# Altium schematic sheet Half_Bridges.SchDoc
size B; DocumentNumber: 6; SheetNumber: 4; SheetTotal: 4
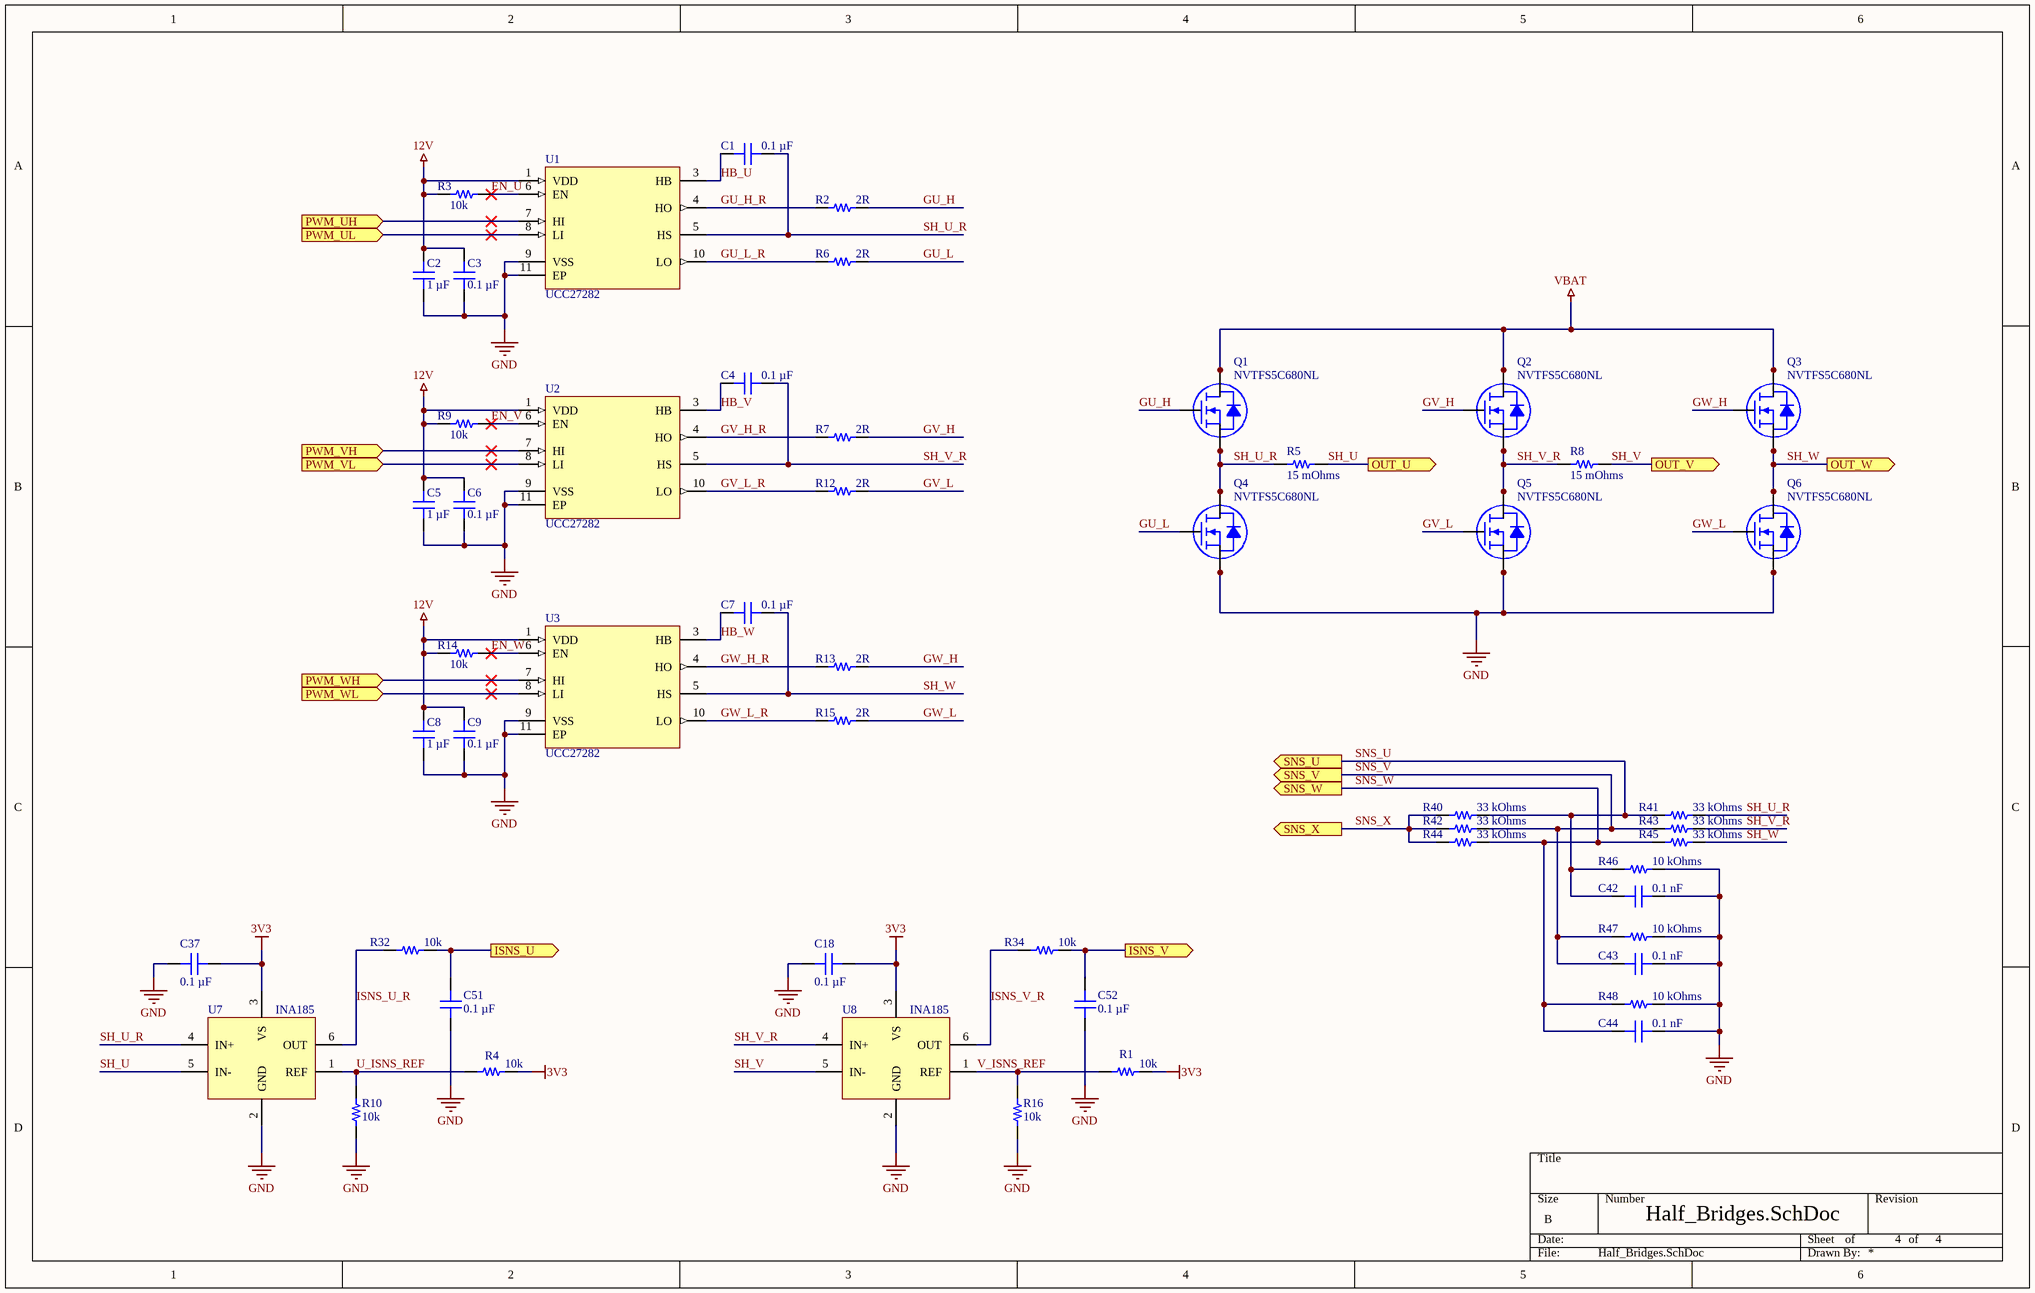
[diagram p0: Half_Bridges.SchDoc]

## Parts
C1  0.1 µF  [CAP 0402_1005]
C2  1 µF  [CAP 0402_1005]
C3  0.1 µF  [CAP 0402_1005]
C4  0.1 µF  [CAP 0402_1005]
C5  1 µF  [CAP 0402_1005]
C6  0.1 µF  [CAP 0402_1005]
C7  0.1 µF  [CAP 0402_1005]
C8  1 µF  [CAP 0402_1005]
C9  0.1 µF  [CAP 0402_1005]
C18  0.1 µF  [CAP 0402_1005]
C37  0.1 µF  [CAP 0402_1005]
C42  0.1 nF  [CAP 0402_1005]
C43  0.1 nF  [CAP 0402_1005]
C44  0.1 nF  [CAP 0402_1005]
C51  0.1 µF  [CAP 0402_1005]
C52  0.1 µF  [CAP 0402_1005]
Q1  NVTFS5C680NL  [NVTFS015N04CTAG]
Q2  NVTFS5C680NL  [NVTFS015N04CTAG]
Q3  NVTFS5C680NL  [NVTFS015N04CTAG]
Q4  NVTFS5C680NL  [NVTFS015N04CTAG]
Q5  NVTFS5C680NL  [NVTFS015N04CTAG]
Q6  NVTFS5C680NL  [NVTFS015N04CTAG]
R1  10k  [RES 0402_1005]
R2  2R  [RES 0402_1005]
R3  10k  [RES 0402_1005]
R4  10k  [RES 0402_1005]
R5  15 mOhms  [RES 1206_3216]
R6  2R  [RES 0402_1005]
R7  2R  [RES 0402_1005]
R8  15 mOhms  [RES 1206_3216]
R9  10k  [RES 0402_1005]
R10  10k  [RES 0402_1005]
R12  2R  [RES 0402_1005]
R13  2R  [RES 0402_1005]
R14  10k  [RES 0402_1005]
R15  2R  [RES 0402_1005]
R16  10k  [RES 0402_1005]
R32  10k  [RES 0402_1005]
R34  10k  [RES 0402_1005]
R40  33 kOhms  [RES 0402_1005]
R41  33 kOhms  [RES 0402_1005]
R42  33 kOhms  [RES 0402_1005]
R43  33 kOhms  [RES 0402_1005]
R44  33 kOhms  [RES 0402_1005]
R45  33 kOhms  [RES 0402_1005]
R46  10 kOhms  [RES 0402_1005]
R47  10 kOhms  [RES 0402_1005]
R48  10 kOhms  [RES 0402_1005]
U1  UCC27282  [VSON-10]
U2  UCC27282  [VSON-10]
U3  UCC27282  [VSON-10]
U7  INA185  [TI SC70-6 DCK]
U8  INA185  [TI SC70-6 DCK]

## Ports
ISNS_U (out), ISNS_V (out), OUT_U (out), OUT_V (out), OUT_W (out), PWM_UH (in), PWM_UL (in), PWM_VH (in), PWM_VL (in), PWM_WH (in), PWM_WL (in), SNS_U (out), SNS_V (out), SNS_W (out), SNS_X (out)

## Nets
3V3: C18.1 C37.1 R1.2 R4.2 U7.3(VS) U8.3(VS)
12V: C2.1 C3.1 C5.1 C6.1 C8.1 C9.1 R3.2 R9.2 R14.2 U1.1(VDD) U2.1(VDD) U3.1(VDD)
GND: C2.2 C3.2 C5.2 C6.2 C8.2 C9.2 C18.2 C37.2 C42.1 C43.1 C44.1 C51.2 C52.2 Q4.1(S) Q4.2(S) Q4.3(S) Q5.1(S) Q5.2(S) Q5.3(S) Q6.1(S) Q6.2(S) Q6.3(S) R10.1 R16.1 R46.1 R47.1 R48.1 U1.9(VSS) U1.11(EP) U2.9(VSS) U2.11(EP) U3.9(VSS) U3.11(EP) U7.2(GND) U8.2(GND)
VBAT: Q1.5(D) Q1.6(D) Q1.7(D) Q1.8(D) Q2.5(D) Q2.6(D) Q2.7(D) Q2.8(D) Q3.5(D) Q3.6(D) Q3.7(D) Q3.8(D)
EN_U: R3.1 U1.6(EN)
EN_V: R9.1 U2.6(EN)
EN_W: R14.1 U3.6(EN)
GU_H: Q1.4(G) R2.1
GU_H_R: R2.2 U1.4(HO)
GU_L: Q4.4(G) R6.1
GU_L_R: R6.2 U1.10(LO)
GV_H: Q2.4(G) R7.1
GV_H_R: R7.2 U2.4(HO)
GV_L: Q5.4(G) R12.1
GV_L_R: R12.2 U2.10(LO)
GW_H: Q3.4(G) R13.1
GW_H_R: R13.2 U3.4(HO)
GW_L: Q6.4(G) R15.1
GW_L_R: R15.2 U3.10(LO)
HB_U: C1.2 U1.3(HB)
HB_V: C4.2 U2.3(HB)
HB_W: C7.2 U3.3(HB)
ISNS_U: C51.1 R32.2 ; port ISNS_U
ISNS_U_R: R32.1 U7.6(OUT)
ISNS_V: C52.1 R34.2 ; port ISNS_V
ISNS_V_R: R34.1 U8.6(OUT)
PWM_UH: U1.7(HI) ; port PWM_UH
PWM_UL: U1.8(LI) ; port PWM_UL
PWM_VH: U2.7(HI) ; port PWM_VH
PWM_VL: U2.8(LI) ; port PWM_VL
PWM_WH: U3.7(HI) ; port PWM_WH
PWM_WL: U3.8(LI) ; port PWM_WL
SH_U: R5.2 U7.5(IN-) ; port OUT_U
SH_U_R: C1.1 Q1.1(S) Q1.2(S) Q1.3(S) Q4.5(D) Q4.6(D) Q4.7(D) Q4.8(D) R5.1 R41.2 U1.5(HS) U7.4(IN+)
SH_V: R8.2 U8.5(IN-) ; port OUT_V
SH_V_R: C4.1 Q2.1(S) Q2.2(S) Q2.3(S) Q5.5(D) Q5.6(D) Q5.7(D) Q5.8(D) R8.1 R43.2 U2.5(HS) U8.4(IN+)
SH_W: C7.1 Q3.1(S) Q3.2(S) Q3.3(S) Q6.5(D) Q6.6(D) Q6.7(D) Q6.8(D) R45.2 U3.5(HS) ; port OUT_W
SNS_U: C42.2 R40.2 R41.1 R46.2 ; port SNS_U
SNS_V: C43.2 R42.2 R43.1 R47.2 ; port SNS_V
SNS_W: C44.2 R44.2 R45.1 R48.2 ; port SNS_W
SNS_X: R40.1 R42.1 R44.1 ; port SNS_X
U_ISNS_REF: R4.1 R10.2 U7.1(REF)
V_ISNS_REF: R1.1 R16.2 U8.1(REF)

## Notes on the sheet
- of

## Library data of the parts
C1 C3 C4 C6 C7 C9 C18 C37 C51 C52 = C0402C104K4RACAUTO: CAP CER 0.1UF 16V X7R 0402; manufacturer: KEMET; Tolerance: ±10%; Part Number: C0402C104K4RACAUTO; Value: 0.1 µF; Applications: Automotive, Bypass, Decoupling; Capacitance: 0.1 µF; componentlink1description: Datasheet; componentlink1url: https://api.kemet.com/component-edge/download/specsheet/C0402C104K4RACAUTO.pdf; componentlink2description: DigiKey Link; componentlink2url: https://www.digikey.com/en/products/detail/kemet/C0402C104K4RACAUTO/3314827; Device Package: 0402 (1005 Metric); lastupdated: 8/14/2022 9:05:51 PM; Lifecycle Status: Active; Minimum Order: 1; Mounting Type: Surface Mount, MLCC; Operating Temperature: -55°C ~ 125°C; Package / Case: 0402 (1005 Metric); packaging: TapeAndReel; partid: 3024; Part Status: Active; price: 0.01; Ratings: AEC-Q200; series: SMD Auto X7R; Size / Dimension: 0.039" L x 0.020" W (1.00mm x 0.50mm); Supplier 1: DigiKey; Supplier Part Number 1: 399-6828-1-ND; Temperature Coefficient: X7R; Thickness (Max): 0.022" (0.55mm); Voltage - Rated: 16V
C2 C5 C8 C42-C44 = C0402C104K4RACAUTO: CAP CER 0.1UF 16V X7R 0402; manufacturer: KEMET; Capacitance: 0.1 µF; Tolerance: ±10%; Part Number: C0402C104K4RACAUTO; Applications: Automotive, Bypass, Decoupling; componentlink1description: Datasheet; componentlink1url: https://api.kemet.com/component-edge/download/specsheet/C0402C104K4RACAUTO.pdf; componentlink2description: DigiKey Link; componentlink2url: https://www.digikey.com/en/products/detail/kemet/C0402C104K4RACAUTO/3314827; Device Package: 0402 (1005 Metric); lastupdated: 8/14/2022 9:05:51 PM; Lifecycle Status: Active; Minimum Order: 1; Mounting Type: Surface Mount, MLCC; Operating Temperature: -55°C ~ 125°C; Package / Case: 0402 (1005 Metric); packaging: TapeAndReel; partid: 3024; Part Status: Active; price: 0.01; Ratings: AEC-Q200; series: SMD Auto X7R; Size / Dimension: 0.039" L x 0.020" W (1.00mm x 0.50mm); Supplier 1: DigiKey; Supplier Part Number 1: 399-6828-1-ND; Temperature Coefficient: X7R; Thickness (Max): 0.022" (0.55mm); Voltage - Rated: 16V
  C2 C5 C8: Value: 1 µF
  C42-C44: Value: 0.1 nF
Q1-Q6 = NVTFS5C680NL: N-FET
R1-R4 R6 R7 R9 R10 R12-R16 R32 R34 R40-R48 = RK73H1ETTP1432F: RES 14.3K OHM 1% 1/10W 0402; Manufacturer: KOA Speer Electronics, Inc.; Power (Watts): 0.1W, 1/10W; Resistance: 14.3 kOhms; Temperature Coefficient: ±100ppm/°C; Part Number: RK73H1ETTP1432F; ComponentLink1Description: Datasheet; ComponentLink1URL: http://www.koaspeer.com/catimages/Products/RK73H/RK73H.pdf; ComponentLink2Description: DigiKey Link; ComponentLink2URL: https://www.digikey.com/en/products/detail/koa-speer-electronics-inc/RK73H1ETTP1432F/9844351; Composition: Thick Film; Device Package: 0402 (1005 Metric); Features: Automotive AEC-Q200, Moisture Resistant; Height - Seated (Max): 0.016" (0.40mm); LastUpdated: 8/14/2022 9:23:49 PM; Lifecycle Status: Active; Minimum Order: 1; Number of Terminations: 2; Operating Temperature: -55°C ~ 155°C; Package / Case: 0402 (1005 Metric); Packaging: CutTape; PartId: 10193; Part Status: Active; Price: 0.01; Ratings: AEC-Q200; Series: RK73H; Size / Dimension: 0.039" L x 0.020" W (1.00mm x 0.50mm); Supplier 1: DigiKey; Supplier Part Number 1: 2019-RK73H1ETTP1432FCT-ND; Supplier Device Package: 0402; Tolerance: ±1%
  R1 R3 R4 R9 R10 R14 R16 R32 R34: Value: 10k
  R2 R6 R7 R12 R13 R15: Value: 2R
  R40-R45: Value: 33 kOhms
  R46-R48: Value: 10 kOhms
R5 R8 = KRL1632E-M-R039-F-T5: RES 0.039 OHM 1% 3/4W 1206; Manufacturer: Susumu; Power (Watts): 0.75W, 3/4W; Resistance: 39 mOhms; Temperature Coefficient: ±50ppm/°C; Value: 39 mOhms; Part Number: KRL1632E-M-R039-F-T5; ComponentLink1Description: Datasheet; ComponentLink1URL: http://www.susumu.co.jp/common/pdf/n_catalog_partition09_en.pdf; ComponentLink2Description: DigiKey Link; ComponentLink2URL: https://www.digikey.com/en/products/detail/susumu/KRL1632E-M-R039-F-T5/3738003; Composition: Metal Foil; Device Package: 1206 (3216 Metric); Features: Automotive AEC-Q200, Current Sense; Height - Seated (Max): 0.028" (0.70mm); LastUpdated: 2/9/2024 8:54:46 PM; Lifecycle Status: Active; Minimum Order: 1; Number of Terminations: 2; Operating Temperature: -55°C ~ 155°C; Package / Case: 1206 (3216 Metric); Packaging: TapeAndReel; PartId: 26838; Part Status: Active; Price: 0.09; Ratings: AEC-Q200; Series: KRL; Size / Dimension: 0.126" L x 0.063" W (3.20mm x 1.60mm); Supplier 1: DigiKey; Supplier Part Number 1: 408-1577-1-ND; Supplier Device Package: 1206; Tolerance: ±1%
U1-U3 = UCC27282DRCR: 3-A, 120-V half bridge gate driver with 5-V UVLO, interlock and enable 10-VSON -40 to 125; MF: Texas Instruments; Texas_Instruments-Purchase-URL: https://snapeda.com/shop?store=Texas+Instruments&id=3625400; Price: None; Availability: Warning; Package: VSON-10 Texas Instruments; SnapEDA_Link: https://www.snapeda.com/parts/UCC27282DRCR/Texas%20Instruments/view-part/3625400/?ref=snap; DigiKey-Purchase-URL: https://snapeda.com/shop?store=DigiKey&id=3625400; MP: UCC27282DRCR; Value: *
U7 U8 = INA185: INA185A2